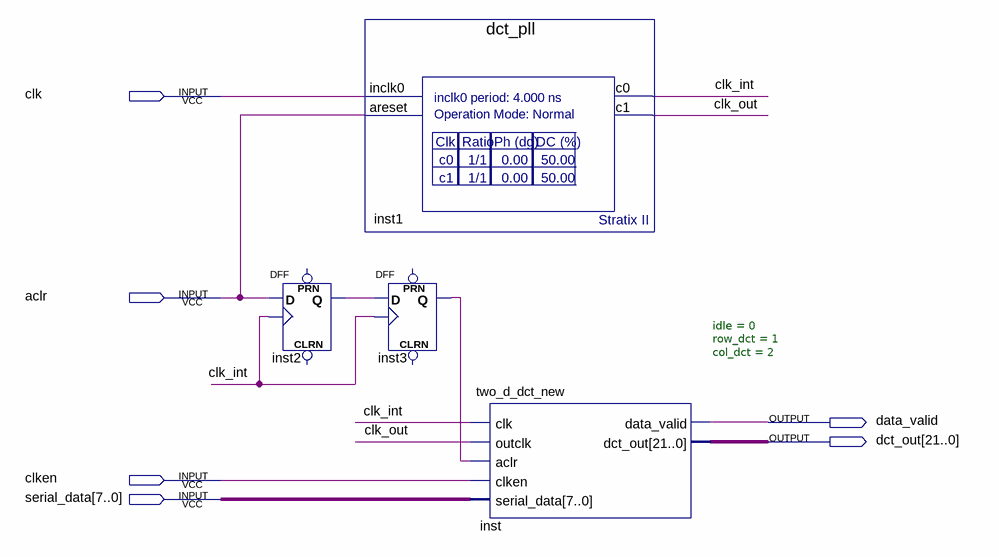
[diagram p0: schematic sheet]
// Quartus schematic top_dct.bdf as structural Verilog: 4 symbols, 6 pins
module top_dct (
  input  clk,
  input  aclr,
  input  clken,
  input  [7:0] serial_data,
  output data_valid,
  output [21:0] dct_out
);

  wire clk_int, clk_out, inst2_q, inst3_q;

  DFF inst2 (.CLK(clk_int), .D(aclr), .Q(inst2_q));  // open: CLRN, PRN
  dct_pll inst1 (.inclk0(clk), .areset(aclr), .c0(clk_int), .c1(clk_out));
  DFF inst3 (.CLK(clk_int), .D(inst2_q), .Q(inst3_q));  // open: CLRN, PRN
  two_d_dct_new #(.idle(0), .row_dct(1), .col_dct(2)) inst (
    .clk(clk_int), .outclk(clk_out), .aclr(inst3_q), .clken(clken), .serial_data(serial_data),
    .data_valid(data_valid), .dct_out(dct_out));
endmodule
